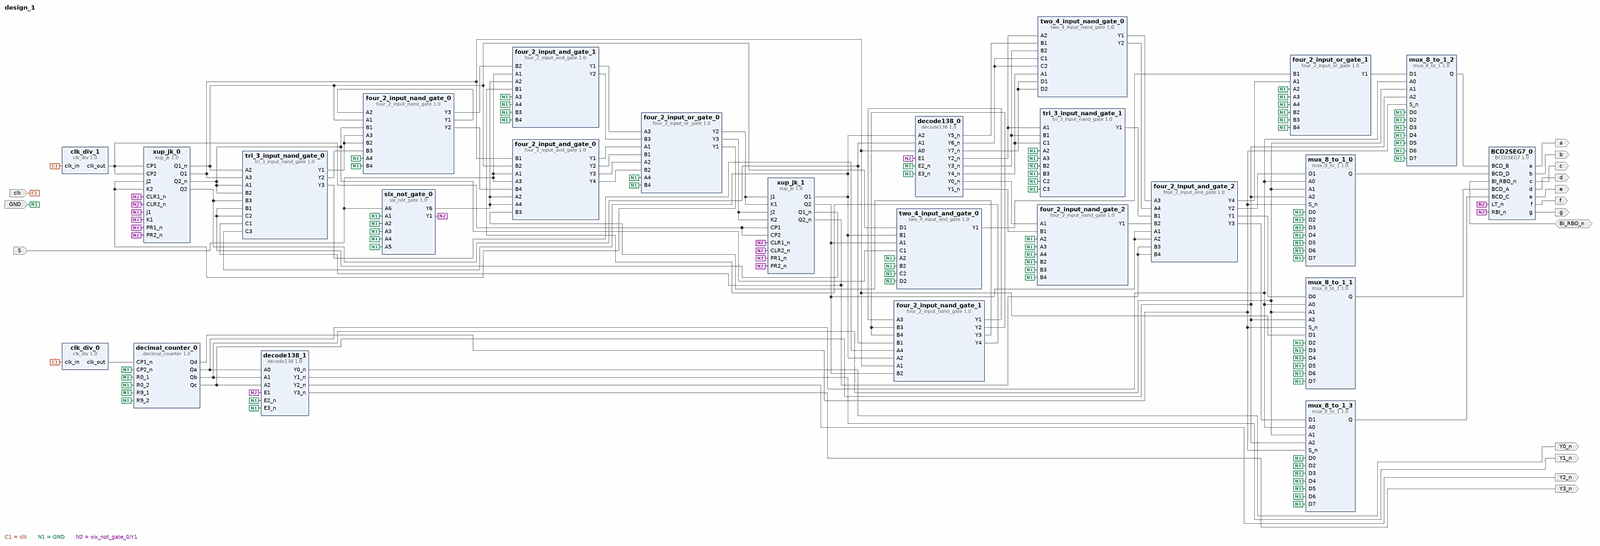
[diagram p0: block diagram of the top level, whole]
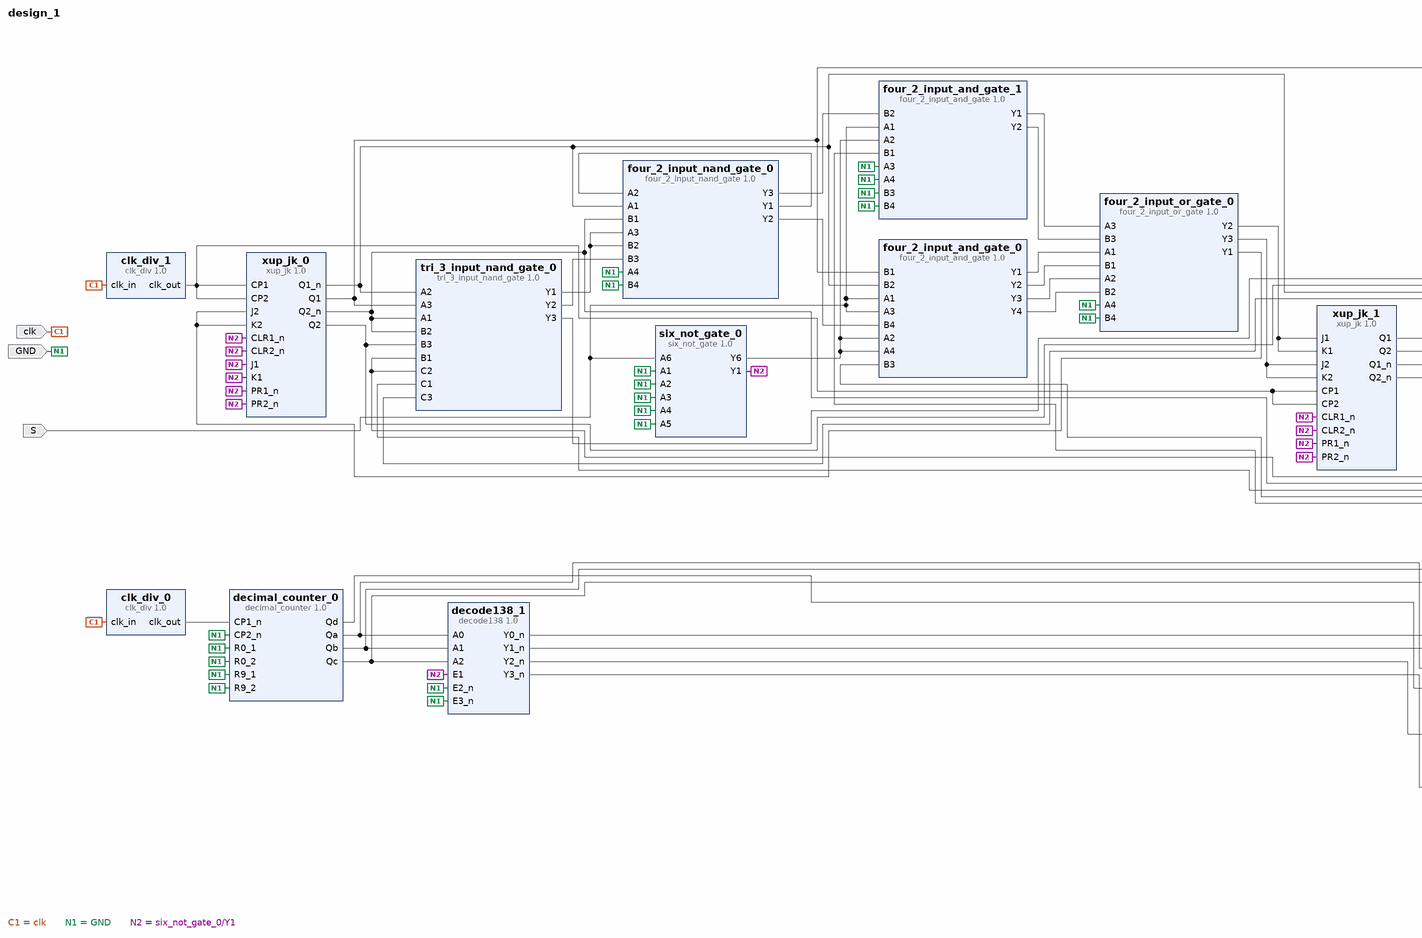
[diagram p1: block diagram of the top level, left part]
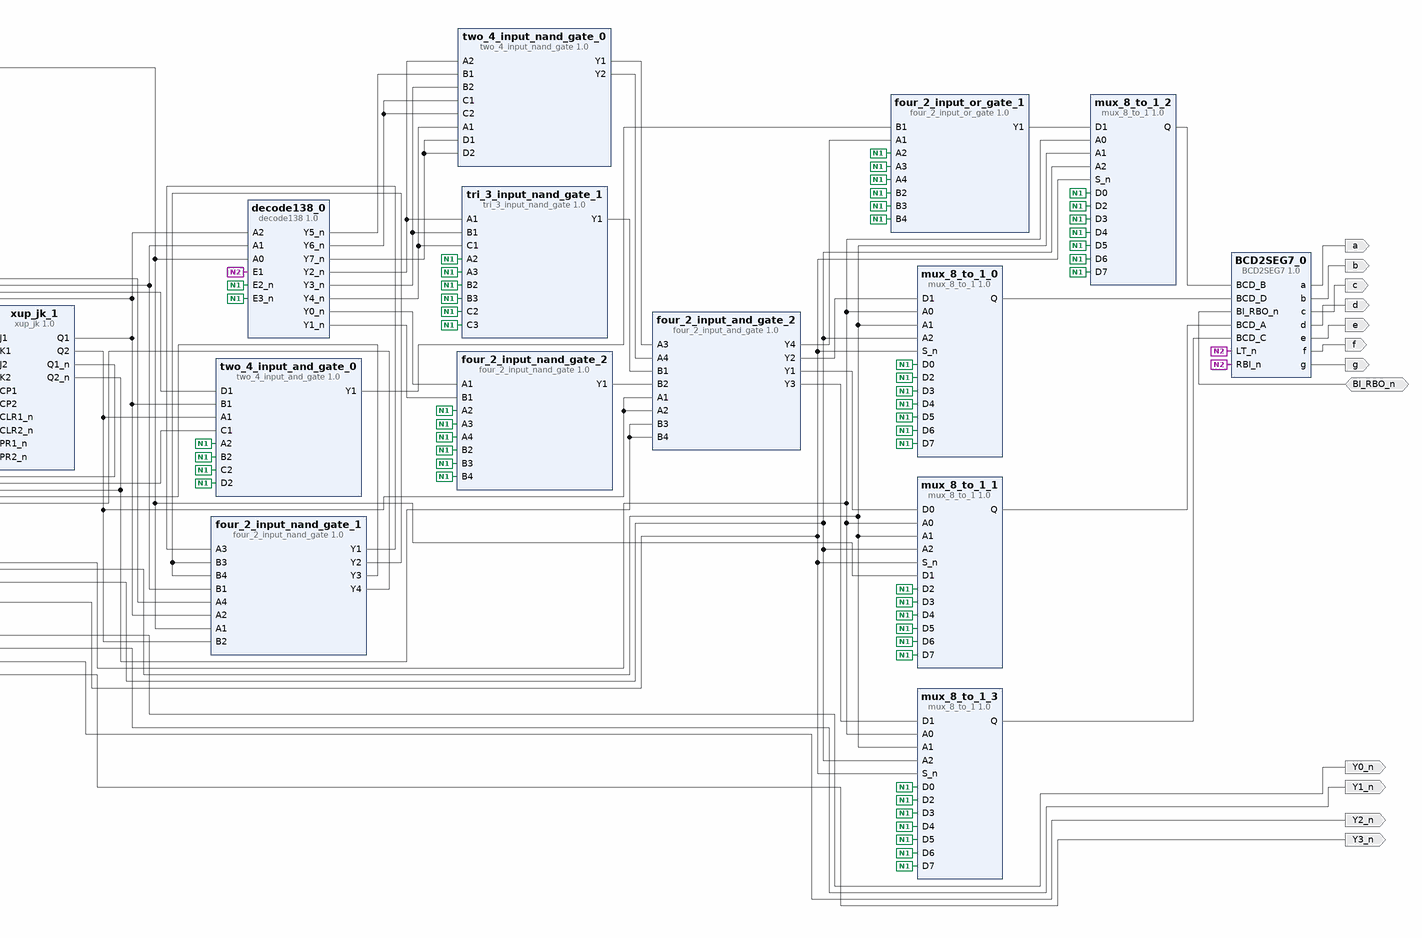
[diagram p2: block diagram of the top level, right part]
# Vivado block design design_1, Vivado 2015.3
create_bd_design design_1

create_bd_port -dir I clk
create_bd_port -dir I GND
create_bd_port -dir I S
create_bd_port -dir O a
create_bd_port -dir O b
create_bd_port -dir O c
create_bd_port -dir O d
create_bd_port -dir O e
create_bd_port -dir O f
create_bd_port -dir O g
create_bd_port -dir IO BI_RBO_n
create_bd_port -dir O Y0_n
create_bd_port -dir O Y1_n
create_bd_port -dir O Y2_n
create_bd_port -dir O Y3_n

create_bd_cell -type ip -vlnv sysu:user:xup_jk:1.0 xup_jk_0
create_bd_cell -type ip -vlnv sysu:user:xup_jk:1.0 xup_jk_1
create_bd_cell -type ip -vlnv xilinx.com:xup:clk_div:1.0 clk_div_0
set_property -dict {CONFIG.N 999999} [get_bd_cells clk_div_0]
create_bd_cell -type ip -vlnv xilinx.com:xup:clk_div:1.0 clk_div_1
set_property -dict {CONFIG.N 99999999} [get_bd_cells clk_div_1]
create_bd_cell -type ip -vlnv xilinx.com:XUP:six_not_gate:1.0 six_not_gate_0
create_bd_cell -type ip -vlnv xilinx.com:XUP:four_2_input_nand_gate:1.0 four_2_input_nand_gate_0
create_bd_cell -type ip -vlnv xilinx.com:XUP:tri_3_input_nand_gate:1.0 tri_3_input_nand_gate_0
create_bd_cell -type ip -vlnv xilinx.com:XUP:four_2_input_nand_gate:1.0 four_2_input_nand_gate_1
create_bd_cell -type ip -vlnv xilinx.com:XUP:four_2_input_and_gate:1.0 four_2_input_and_gate_0
create_bd_cell -type ip -vlnv xilinx.com:XUP:four_2_input_or_gate:1.0 four_2_input_or_gate_0
create_bd_cell -type ip -vlnv xilinx.com:XUP:four_2_input_and_gate:1.0 four_2_input_and_gate_1
create_bd_cell -type ip -vlnv xilinx.com:XUP:decode138:1.0 decode138_0
create_bd_cell -type ip -vlnv xilinx.com:XUP:four_2_input_nand_gate:1.0 four_2_input_nand_gate_2
create_bd_cell -type ip -vlnv xilinx.com:XUP:tri_3_input_nand_gate:1.0 tri_3_input_nand_gate_1
create_bd_cell -type ip -vlnv xilinx.com:XUP:two_4_input_nand_gate:1.0 two_4_input_nand_gate_0
create_bd_cell -type ip -vlnv xilinx.com:XUP:four_2_input_and_gate:1.0 four_2_input_and_gate_2
create_bd_cell -type ip -vlnv xilinx.com:XUP:two_4_input_and_gate:1.0 two_4_input_and_gate_0
create_bd_cell -type ip -vlnv xilinx.com:XUP:four_2_input_or_gate:1.0 four_2_input_or_gate_1
create_bd_cell -type ip -vlnv xilinx.com:xup:decimal_counter:1.0 decimal_counter_0
create_bd_cell -type ip -vlnv xilinx.com:xup:mux_8_to_1:1.0 mux_8_to_1_0
create_bd_cell -type ip -vlnv xilinx.com:xup:mux_8_to_1:1.0 mux_8_to_1_1
create_bd_cell -type ip -vlnv xilinx.com:xup:mux_8_to_1:1.0 mux_8_to_1_2
create_bd_cell -type ip -vlnv xilinx.com:xup:mux_8_to_1:1.0 mux_8_to_1_3
create_bd_cell -type ip -vlnv xilinx.com:xup:BCD2SEG7:1.0 BCD2SEG7_0
create_bd_cell -type ip -vlnv xilinx.com:XUP:decode138:1.0 decode138_1

# ---- connections ----

connect_bd_net -net clk_in_1 [get_bd_ports clk] [get_bd_pins clk_div_1/clk_in] [get_bd_pins clk_div_0/clk_in]
connect_bd_net [get_bd_pins clk_div_1/clk_out] \
  [get_bd_pins xup_jk_0/CP1] [get_bd_pins xup_jk_0/CP2] [get_bd_pins xup_jk_1/CP1] [get_bd_pins xup_jk_1/CP2]
connect_bd_net -net A1_1 [get_bd_ports GND] \
  [get_bd_pins six_not_gate_0/A1] [get_bd_pins mux_8_to_1_0/D0] [get_bd_pins mux_8_to_1_3/D0] [get_bd_pins mux_8_to_1_2/D0] \
  [get_bd_pins decimal_counter_0/CP2_n] [get_bd_pins decimal_counter_0/R0_1] [get_bd_pins decimal_counter_0/R0_2] \
  [get_bd_pins decimal_counter_0/R9_1] [get_bd_pins decimal_counter_0/R9_2] [get_bd_pins mux_8_to_1_0/D2] \
  [get_bd_pins mux_8_to_1_0/D3] [get_bd_pins mux_8_to_1_0/D4] [get_bd_pins mux_8_to_1_0/D5] [get_bd_pins mux_8_to_1_0/D6] \
  [get_bd_pins mux_8_to_1_0/D7] [get_bd_pins mux_8_to_1_3/D7] [get_bd_pins mux_8_to_1_3/D6] [get_bd_pins mux_8_to_1_3/D5] \
  [get_bd_pins mux_8_to_1_3/D4] [get_bd_pins mux_8_to_1_3/D3] [get_bd_pins mux_8_to_1_3/D2] [get_bd_pins mux_8_to_1_2/D2] \
  [get_bd_pins mux_8_to_1_2/D3] [get_bd_pins mux_8_to_1_2/D4] [get_bd_pins mux_8_to_1_2/D5] [get_bd_pins mux_8_to_1_2/D6] \
  [get_bd_pins mux_8_to_1_2/D7] [get_bd_pins mux_8_to_1_1/D7] [get_bd_pins mux_8_to_1_1/D6] [get_bd_pins mux_8_to_1_1/D5] \
  [get_bd_pins mux_8_to_1_1/D4] [get_bd_pins mux_8_to_1_1/D3] [get_bd_pins mux_8_to_1_1/D2] [get_bd_pins decode138_1/E2_n] \
  [get_bd_pins decode138_1/E3_n] [get_bd_pins four_2_input_or_gate_1/A2] [get_bd_pins four_2_input_or_gate_1/B2] \
  [get_bd_pins four_2_input_or_gate_1/A3] [get_bd_pins four_2_input_or_gate_1/B3] [get_bd_pins four_2_input_or_gate_1/A4] \
  [get_bd_pins four_2_input_or_gate_1/B4] [get_bd_pins two_4_input_and_gate_0/A2] [get_bd_pins two_4_input_and_gate_0/B2] \
  [get_bd_pins two_4_input_and_gate_0/C2] [get_bd_pins two_4_input_and_gate_0/D2] [get_bd_pins tri_3_input_nand_gate_1/A2] \
  [get_bd_pins tri_3_input_nand_gate_1/B2] [get_bd_pins tri_3_input_nand_gate_1/C2] [get_bd_pins tri_3_input_nand_gate_1/A3] \
  [get_bd_pins tri_3_input_nand_gate_1/B3] [get_bd_pins tri_3_input_nand_gate_1/C3] [get_bd_pins four_2_input_nand_gate_2/A2] \
  [get_bd_pins four_2_input_nand_gate_2/B2] [get_bd_pins four_2_input_nand_gate_2/A3] \
  [get_bd_pins four_2_input_nand_gate_2/B3] [get_bd_pins four_2_input_nand_gate_2/A4] \
  [get_bd_pins four_2_input_nand_gate_2/B4] [get_bd_pins decode138_0/E2_n] [get_bd_pins decode138_0/E3_n] \
  [get_bd_pins four_2_input_or_gate_0/A4] [get_bd_pins four_2_input_or_gate_0/B4] [get_bd_pins four_2_input_nand_gate_0/A4] \
  [get_bd_pins four_2_input_nand_gate_0/B4] [get_bd_pins six_not_gate_0/A2] [get_bd_pins six_not_gate_0/A3] \
  [get_bd_pins six_not_gate_0/A4] [get_bd_pins six_not_gate_0/A5] [get_bd_pins four_2_input_and_gate_1/A3] \
  [get_bd_pins four_2_input_and_gate_1/B3] [get_bd_pins four_2_input_and_gate_1/A4] [get_bd_pins four_2_input_and_gate_1/B4]
connect_bd_net [get_bd_pins six_not_gate_0/Y1] \
  [get_bd_pins xup_jk_0/J1] [get_bd_pins xup_jk_0/K1] [get_bd_pins BCD2SEG7_0/LT_n] [get_bd_pins BCD2SEG7_0/RBI_n] \
  [get_bd_pins decode138_1/E1] [get_bd_pins decode138_0/E1] [get_bd_pins xup_jk_0/CLR1_n] [get_bd_pins xup_jk_0/CLR2_n] \
  [get_bd_pins xup_jk_1/CLR1_n] [get_bd_pins xup_jk_1/CLR2_n] [get_bd_pins xup_jk_0/PR1_n] [get_bd_pins xup_jk_0/PR2_n] \
  [get_bd_pins xup_jk_1/PR1_n] [get_bd_pins xup_jk_1/PR2_n]
connect_bd_net [get_bd_pins xup_jk_0/Q1_n] \
  [get_bd_pins four_2_input_nand_gate_0/A1] [get_bd_pins tri_3_input_nand_gate_0/A2] [get_bd_pins four_2_input_and_gate_0/B2] \
  [get_bd_pins two_4_input_and_gate_0/D1]
connect_bd_net [get_bd_pins xup_jk_0/Q2_n] \
  [get_bd_pins four_2_input_nand_gate_0/B1] [get_bd_pins tri_3_input_nand_gate_0/A1] [get_bd_pins tri_3_input_nand_gate_0/B2] \
  [get_bd_pins two_4_input_and_gate_0/C1]
connect_bd_net [get_bd_pins xup_jk_1/Q1_n] [get_bd_pins tri_3_input_nand_gate_0/B1] [get_bd_pins tri_3_input_nand_gate_0/C2]
connect_bd_net [get_bd_pins xup_jk_1/Q2_n] \
  [get_bd_pins tri_3_input_nand_gate_0/C1] [get_bd_pins four_2_input_and_gate_2/B3] [get_bd_pins four_2_input_and_gate_2/B4]
connect_bd_net [get_bd_pins four_2_input_nand_gate_0/Y1] [get_bd_pins four_2_input_nand_gate_0/A2]
connect_bd_net [get_bd_pins tri_3_input_nand_gate_0/Y1] [get_bd_pins four_2_input_nand_gate_0/B2] [get_bd_pins four_2_input_nand_gate_0/A3]
connect_bd_net [get_bd_pins tri_3_input_nand_gate_0/Y2] [get_bd_pins four_2_input_nand_gate_0/B3]
connect_bd_net [get_bd_pins xup_jk_0/Q1] \
  [get_bd_pins four_2_input_nand_gate_1/A1] [get_bd_pins tri_3_input_nand_gate_0/A3] [get_bd_pins four_2_input_and_gate_0/B1] \
  [get_bd_pins decode138_0/A0] [get_bd_pins mux_8_to_1_1/D1]
connect_bd_net [get_bd_pins xup_jk_0/Q2] \
  [get_bd_pins four_2_input_nand_gate_1/B1] [get_bd_pins tri_3_input_nand_gate_0/B3] [get_bd_pins decode138_0/A1]
connect_bd_net [get_bd_pins xup_jk_1/Q1] \
  [get_bd_pins four_2_input_nand_gate_1/A2] [get_bd_pins tri_3_input_nand_gate_0/C3] [get_bd_pins decode138_0/A2] \
  [get_bd_pins two_4_input_and_gate_0/B1]
connect_bd_net [get_bd_pins xup_jk_1/Q2] \
  [get_bd_pins four_2_input_nand_gate_1/B2] [get_bd_pins four_2_input_and_gate_2/A1] [get_bd_pins four_2_input_and_gate_2/A2] \
  [get_bd_pins two_4_input_and_gate_0/A1]
connect_bd_net [get_bd_pins four_2_input_nand_gate_1/Y1] [get_bd_pins four_2_input_nand_gate_1/A3]
connect_bd_net [get_bd_pins four_2_input_nand_gate_1/Y2] [get_bd_pins four_2_input_nand_gate_1/B3] [get_bd_pins four_2_input_nand_gate_1/B4]
connect_bd_net [get_bd_pins tri_3_input_nand_gate_0/Y3] [get_bd_pins four_2_input_nand_gate_1/A4]
connect_bd_net [get_bd_pins six_not_gate_0/Y6] \
  [get_bd_pins four_2_input_and_gate_0/A2] [get_bd_pins four_2_input_and_gate_0/A4] [get_bd_pins four_2_input_and_gate_1/A2]
connect_bd_net [get_bd_pins four_2_input_and_gate_0/Y1] [get_bd_pins four_2_input_or_gate_0/A1]
connect_bd_net [get_bd_pins four_2_input_and_gate_0/Y2] [get_bd_pins four_2_input_or_gate_0/B1]
connect_bd_net [get_bd_pins four_2_input_or_gate_0/Y1] [get_bd_pins xup_jk_0/J2] [get_bd_pins xup_jk_0/K2]
connect_bd_net [get_bd_pins four_2_input_nand_gate_0/Y2] [get_bd_pins four_2_input_and_gate_0/B4]
connect_bd_net [get_bd_pins four_2_input_nand_gate_1/Y3] [get_bd_pins four_2_input_and_gate_0/B3]
connect_bd_net [get_bd_pins four_2_input_nand_gate_1/Y4] [get_bd_pins four_2_input_and_gate_1/B1]
connect_bd_net [get_bd_pins four_2_input_nand_gate_0/Y3] [get_bd_pins four_2_input_and_gate_1/B2]
connect_bd_net [get_bd_pins four_2_input_and_gate_0/Y3] [get_bd_pins four_2_input_or_gate_0/A2]
connect_bd_net [get_bd_pins four_2_input_and_gate_0/Y4] [get_bd_pins four_2_input_or_gate_0/B2]
connect_bd_net [get_bd_pins four_2_input_and_gate_1/Y1] [get_bd_pins four_2_input_or_gate_0/A3]
connect_bd_net [get_bd_pins four_2_input_and_gate_1/Y2] [get_bd_pins four_2_input_or_gate_0/B3]
connect_bd_net [get_bd_pins four_2_input_or_gate_0/Y2] [get_bd_pins xup_jk_1/J1] [get_bd_pins xup_jk_1/K1]
connect_bd_net [get_bd_pins four_2_input_or_gate_0/Y3] [get_bd_pins xup_jk_1/J2] [get_bd_pins xup_jk_1/K2]
connect_bd_net [get_bd_pins decode138_0/Y2_n] [get_bd_pins tri_3_input_nand_gate_1/A1] [get_bd_pins two_4_input_nand_gate_0/A2]
connect_bd_net [get_bd_pins decode138_0/Y3_n] [get_bd_pins tri_3_input_nand_gate_1/B1] [get_bd_pins two_4_input_nand_gate_0/B2]
connect_bd_net [get_bd_pins decode138_0/Y4_n] [get_bd_pins tri_3_input_nand_gate_1/C1] [get_bd_pins two_4_input_nand_gate_0/A1]
connect_bd_net [get_bd_pins decode138_0/Y0_n] [get_bd_pins four_2_input_nand_gate_2/A1]
connect_bd_net [get_bd_pins decode138_0/Y1_n] [get_bd_pins four_2_input_nand_gate_2/B1]
connect_bd_net [get_bd_pins tri_3_input_nand_gate_1/Y1] [get_bd_pins four_2_input_and_gate_2/B1]
connect_bd_net [get_bd_pins four_2_input_nand_gate_2/Y1] [get_bd_pins four_2_input_and_gate_2/B2]
connect_bd_net [get_bd_pins decode138_0/Y5_n] [get_bd_pins two_4_input_nand_gate_0/B1]
connect_bd_net [get_bd_pins decode138_0/Y6_n] [get_bd_pins two_4_input_nand_gate_0/C1] [get_bd_pins two_4_input_nand_gate_0/C2]
connect_bd_net [get_bd_pins decode138_0/Y7_n] [get_bd_pins two_4_input_nand_gate_0/D1] [get_bd_pins two_4_input_nand_gate_0/D2]
connect_bd_net [get_bd_pins two_4_input_nand_gate_0/Y1] [get_bd_pins four_2_input_and_gate_2/A3]
connect_bd_net [get_bd_pins two_4_input_nand_gate_0/Y2] [get_bd_pins four_2_input_and_gate_2/A4]
connect_bd_net [get_bd_pins four_2_input_and_gate_2/Y4] [get_bd_pins four_2_input_or_gate_1/A1]
connect_bd_net [get_bd_pins two_4_input_and_gate_0/Y1] [get_bd_pins four_2_input_or_gate_1/B1]
connect_bd_net [get_bd_pins clk_div_0/clk_out] [get_bd_pins decimal_counter_0/CP1_n]
connect_bd_net [get_bd_pins four_2_input_and_gate_2/Y1] [get_bd_pins mux_8_to_1_1/D0]
connect_bd_net [get_bd_pins four_2_input_and_gate_2/Y2] [get_bd_pins mux_8_to_1_0/D1]
connect_bd_net [get_bd_pins four_2_input_and_gate_2/Y3] [get_bd_pins mux_8_to_1_3/D1]
connect_bd_net [get_bd_pins four_2_input_or_gate_1/Y1] [get_bd_pins mux_8_to_1_2/D1]
connect_bd_net [get_bd_pins decimal_counter_0/Qa] \
  [get_bd_pins mux_8_to_1_0/A0] [get_bd_pins mux_8_to_1_3/A0] [get_bd_pins mux_8_to_1_2/A0] [get_bd_pins mux_8_to_1_1/A0] \
  [get_bd_pins decode138_1/A0]
connect_bd_net [get_bd_pins decimal_counter_0/Qb] \
  [get_bd_pins mux_8_to_1_0/A1] [get_bd_pins mux_8_to_1_3/A1] [get_bd_pins mux_8_to_1_2/A1] [get_bd_pins mux_8_to_1_1/A1] \
  [get_bd_pins decode138_1/A1]
connect_bd_net [get_bd_pins decimal_counter_0/Qc] \
  [get_bd_pins mux_8_to_1_0/A2] [get_bd_pins mux_8_to_1_3/A2] [get_bd_pins mux_8_to_1_1/A2] [get_bd_pins mux_8_to_1_2/A2] \
  [get_bd_pins decode138_1/A2]
connect_bd_net [get_bd_pins decimal_counter_0/Qd] \
  [get_bd_pins mux_8_to_1_0/S_n] [get_bd_pins mux_8_to_1_3/S_n] [get_bd_pins mux_8_to_1_2/S_n] [get_bd_pins mux_8_to_1_1/S_n]
connect_bd_net [get_bd_pins mux_8_to_1_0/Q] [get_bd_pins BCD2SEG7_0/BCD_D]
connect_bd_net [get_bd_pins mux_8_to_1_3/Q] [get_bd_pins BCD2SEG7_0/BCD_C]
connect_bd_net [get_bd_pins mux_8_to_1_2/Q] [get_bd_pins BCD2SEG7_0/BCD_B]
connect_bd_net [get_bd_pins mux_8_to_1_1/Q] [get_bd_pins BCD2SEG7_0/BCD_A]
connect_bd_net [get_bd_pins BCD2SEG7_0/a] [get_bd_ports a]
connect_bd_net [get_bd_pins BCD2SEG7_0/b] [get_bd_ports b]
connect_bd_net [get_bd_pins BCD2SEG7_0/c] [get_bd_ports c]
connect_bd_net [get_bd_pins BCD2SEG7_0/d] [get_bd_ports d]
connect_bd_net [get_bd_pins BCD2SEG7_0/e] [get_bd_ports e]
connect_bd_net [get_bd_pins BCD2SEG7_0/f] [get_bd_ports f]
connect_bd_net [get_bd_pins BCD2SEG7_0/g] [get_bd_ports g]
connect_bd_net [get_bd_pins decode138_1/Y0_n] [get_bd_ports Y0_n]
connect_bd_net [get_bd_pins decode138_1/Y1_n] [get_bd_ports Y1_n]
connect_bd_net [get_bd_ports S] \
  [get_bd_pins six_not_gate_0/A6] [get_bd_pins four_2_input_and_gate_1/A1] [get_bd_pins four_2_input_and_gate_0/A1] \
  [get_bd_pins four_2_input_and_gate_0/A3]
connect_bd_net [get_bd_ports BI_RBO_n] [get_bd_pins BCD2SEG7_0/BI_RBO_n]
connect_bd_net [get_bd_pins decode138_1/Y2_n] [get_bd_ports Y2_n]
connect_bd_net [get_bd_pins decode138_1/Y3_n] [get_bd_ports Y3_n]

validate_bd_design
save_bd_design
